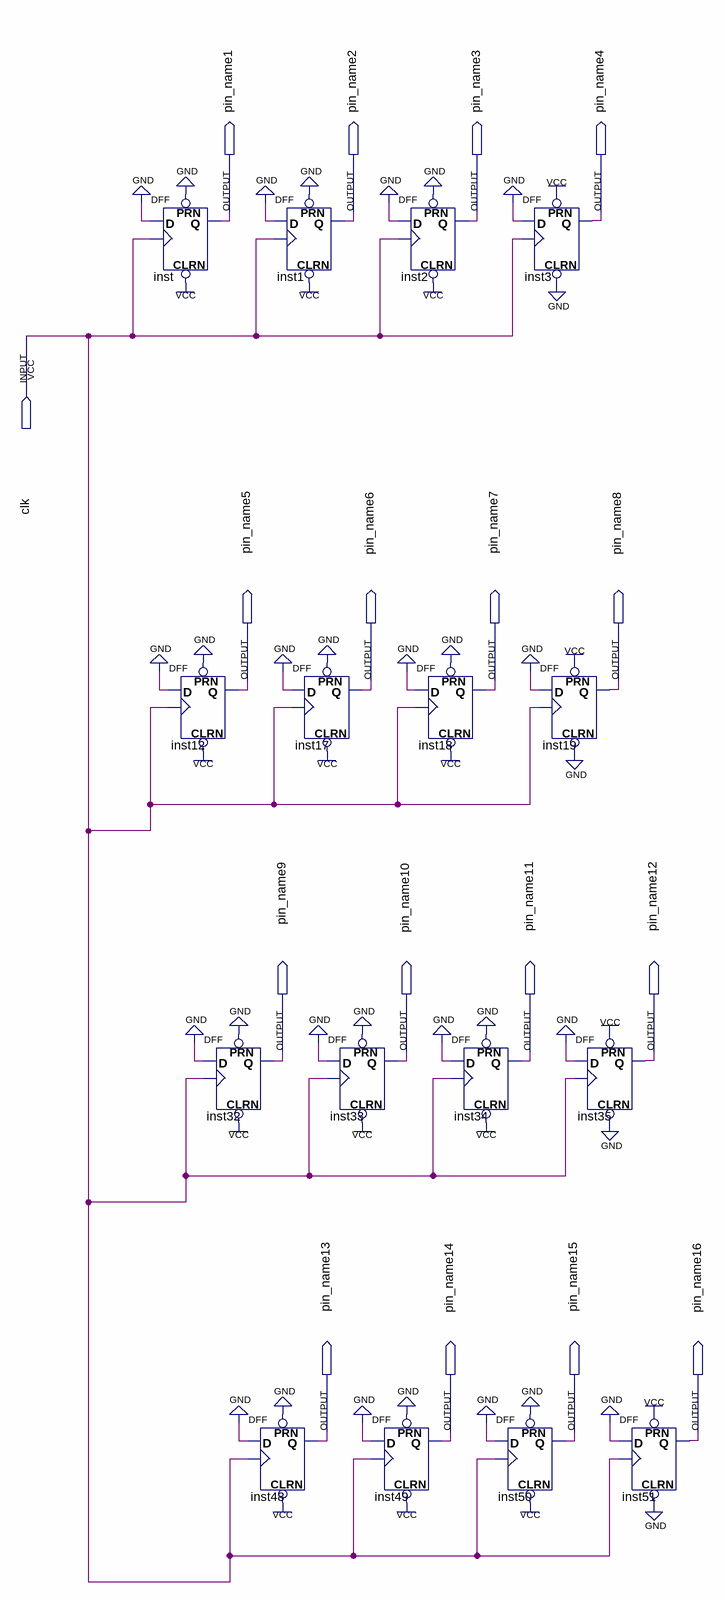
[diagram p0: schematic sheet]
// Quartus schematic registrador.bdf as structural Verilog: 16 symbols, 17 pins
module registrador (
  input  clk,
  output pin_name1,
  output pin_name2,
  output pin_name3,
  output pin_name4,
  output pin_name5,
  output pin_name6,
  output pin_name7,
  output pin_name8,
  output pin_name9,
  output pin_name10,
  output pin_name11,
  output pin_name12,
  output pin_name13,
  output pin_name14,
  output pin_name15,
  output pin_name16
);

  DFF inst (.CLRN(1'b1), .CLK(clk), .D(1'b0), .PRN(1'b0), .Q(pin_name1));
  DFF inst12 (.CLRN(1'b1), .CLK(clk), .D(1'b0), .PRN(1'b0), .Q(pin_name5));
  DFF inst32 (.CLRN(1'b1), .CLK(clk), .D(1'b0), .PRN(1'b0), .Q(pin_name9));
  DFF inst1 (.CLRN(1'b1), .CLK(clk), .D(1'b0), .PRN(1'b0), .Q(pin_name2));
  DFF inst17 (.CLRN(1'b1), .CLK(clk), .D(1'b0), .PRN(1'b0), .Q(pin_name6));
  DFF inst48 (.CLRN(1'b1), .CLK(clk), .D(1'b0), .PRN(1'b0), .Q(pin_name13));
  DFF inst33 (.CLRN(1'b1), .CLK(clk), .D(1'b0), .PRN(1'b0), .Q(pin_name10));
  DFF inst49 (.CLRN(1'b1), .CLK(clk), .D(1'b0), .PRN(1'b0), .Q(pin_name14));
  DFF inst2 (.CLRN(1'b1), .CLK(clk), .D(1'b0), .PRN(1'b0), .Q(pin_name3));
  DFF inst18 (.CLRN(1'b1), .CLK(clk), .D(1'b0), .PRN(1'b0), .Q(pin_name7));
  DFF inst34 (.CLRN(1'b1), .CLK(clk), .D(1'b0), .PRN(1'b0), .Q(pin_name11));
  DFF inst3 (.CLRN(1'b0), .CLK(clk), .D(1'b0), .PRN(1'b1), .Q(pin_name4));
  DFF inst50 (.CLRN(1'b1), .CLK(clk), .D(1'b0), .PRN(1'b0), .Q(pin_name15));
  DFF inst19 (.CLRN(1'b0), .CLK(clk), .D(1'b0), .PRN(1'b1), .Q(pin_name8));
  DFF inst35 (.CLRN(1'b0), .CLK(clk), .D(1'b0), .PRN(1'b1), .Q(pin_name12));
  DFF inst51 (.CLRN(1'b0), .CLK(clk), .D(1'b0), .PRN(1'b1), .Q(pin_name16));
endmodule
